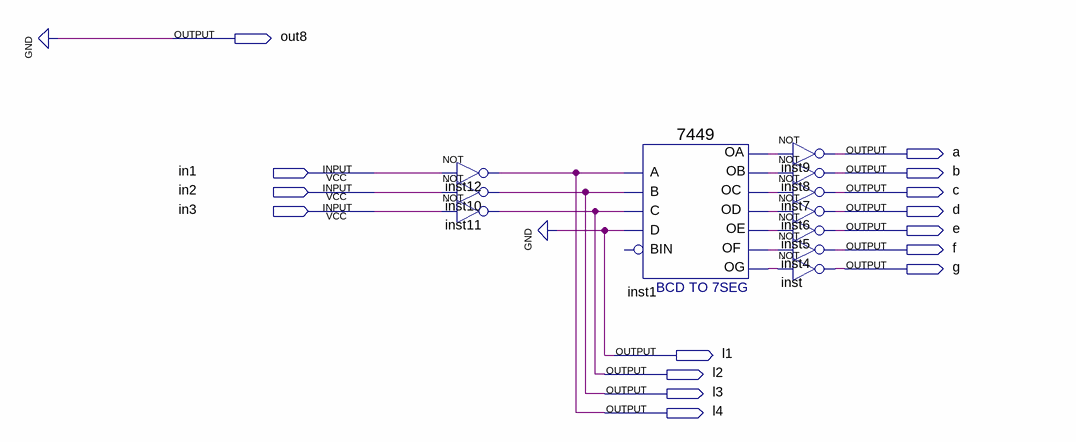
[diagram p0: schematic sheet]
// Quartus schematic NumbLock.bdf as structural Verilog: 11 symbols, 15 pins
module NumbLock (
  input  in1,
  input  in2,
  input  in3,
  output out8,
  output a,
  output b,
  output c,
  output d,
  output e,
  output f,
  output g,
  output l1,
  output l2,
  output l3,
  output l4
);

  wire inst1_oa, inst1_ob, inst1_oc, inst1_od, inst1_oe, inst1_of, inst1_og;

  not inst12 (l4, in1);
  not inst10 (l3, in2);
  not inst11 (l2, in3);
  \7449  inst1 (
    .A(l4), .C(l2), .B(l3), .D(1'b0), .OC(inst1_oc), .OD(inst1_od), .OF(inst1_of), .OG(inst1_og),
    .OB(inst1_ob), .OA(inst1_oa), .OE(inst1_oe));  // open: BIN
  not inst9 (a, inst1_oa);
  not inst8 (b, inst1_ob);
  not inst7 (c, inst1_oc);
  not inst6 (d, inst1_od);
  not inst5 (e, inst1_oe);
  not inst4 (f, inst1_of);
  not inst (g, inst1_og);

  assign l1 = 1'b0;
  assign out8 = 1'b0;
endmodule
